# EAGLE schematic DDS Tone Shield (EAGLE 8.1.1)
REV: 0.10
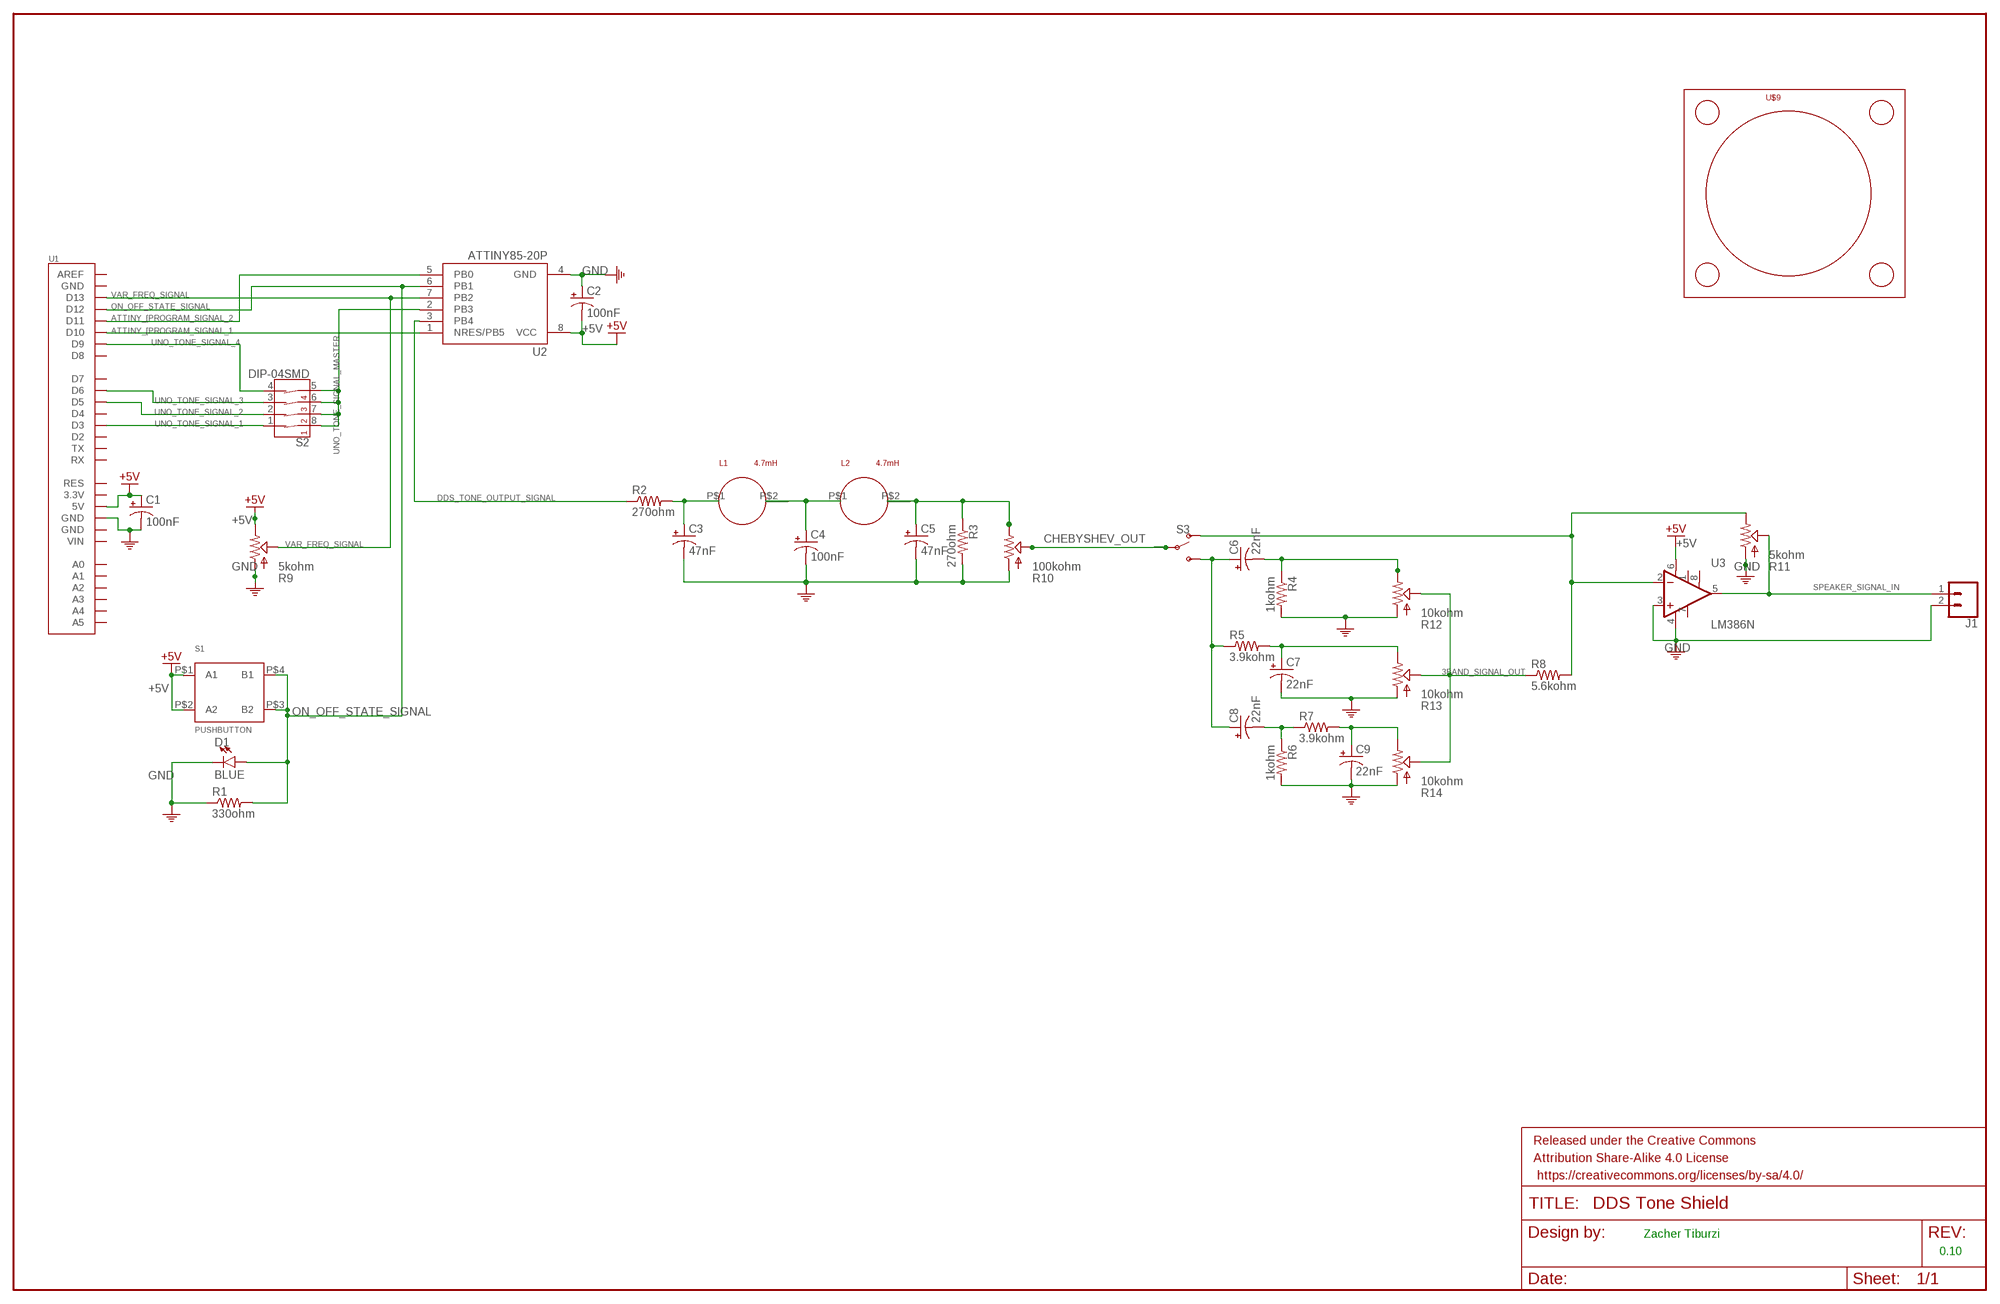
[diagram p0: schematic, sheet 1]

## Parts
C1  100nF  CAP_POL1206  [EIA3216]
C2  100nF  CAP_POL1206  [EIA3216]
C3  47nF  CAP_POL1206  [EIA3216]
C4  100nF  CAP_POL1206  [EIA3216]
C5  47nF  CAP_POL1206  [EIA3216]
C6  22nF  CAP_POL1206  [EIA3216]
C7  22nF  CAP_POL1206  [EIA3216]
C8  22nF  CAP_POL1206  [EIA3216]
C9  22nF  CAP_POL1206  [EIA3216]
D1  BLUE  LED-BLUE1206  [LED-1206]
FRAME2  FRAME-LEDGER  [CREATIVE_COMMONS]
J1  CONN_02  [1X02]
L1  4.7mH  INDUCTOR  [SDR0503-472JL]
L2  4.7mH  INDUCTOR  [SDR0503-472JL]
R1  330ohm  RESISTOR1206  [1206]
R2  270ohm  RESISTOR1206  [1206]
R3  270ohm  RESISTOR1206  [1206]
R4  1kohm  RESISTOR1206  [1206]
R5  3.9kohm  RESISTOR1206  [1206]
R6  1kohm  RESISTOR1206  [1206]
R7  3.9kohm  RESISTOR1206  [1206]
R8  5.6kohm  RESISTOR1206  [1206]
R9  5kohm  POT1  [RK09K/RK09D_SERIES]
R10  100kohm  POT2  [5150500311]
R11  5kohm  POT1  [RK09K/RK09D_SERIES]
R12  10kohm  POT1  [RK09K/RK09D_SERIES]
R13  10kohm  POT1  [RK09K/RK09D_SERIES]
R14  10kohm  POT1  [RK09K/RK09D_SERIES]
S1  PUSHBUTTON  [3CSH9_MEC_PUSHBUTTON]
S2  DIP-04SMD  [DIPSWITCH-04-SMD]
S3  SWITCH-SPDT  [JS102011SAQN]
U1  ARDUINO_SHIELD  [DUEMILANOVE_SHIELD]
U2  ATTINY85-20P  [PDIP08_300MIL]
U3  LM386N  LM386  [DIP08]
U$9  SPEAKER  [CSS-40408N]

## Nets
3BAND_SIGNAL_OUT: R8.1 R12.P$2(S) R13.P$2(S) R14.P$2(S)
+5V: C1.A(+) C2.C(-) R9.P$3(E) S1.P$1(A1) S1.P$2(A2) U1.5V U2.8(VCC) U3.6(V+)
ATTINY_[PROGRAM_SIGNAL_1: U1.D10 U2.1(NRES/PB5)
ATTINY_[PROGRAM_SIGNAL_2: U1.D11 U2.5(PB0)
CHEBYSHEV_OUT: R10.P$20(S) S3.P$3(P)
DDS_TONE_OUTPUT_SIGNAL: R2.1 U2.3(PB4)
GND: C1.C(-) C2.A(+) C3.C(-) C4.C(-) C5.C(-) C7.C(-) C9.C(-) D1.C J1.2 R1.1 R3.2 R4.2 R6.2 R9.P$1(A) R10.P$10(A) R11.P$1(A) R12.P$1(A) R13.P$1(A) R14.P$1(A) U1.GND@1(GND) U2.4(GND) U3.3(+IN) U3.4(V-) ; supply symbol labelled GND_US
N$13: C3.A(+) L1.P$1 R2.2
N$14: C4.A(+) L1.P$2 L2.P$1
N$15: C5.A(+) L2.P$2 R3.1 R10.P$30(E)
N$17: R8.2 R11.P$3(E) S3.P$2(O) U3.2(-IN)
N$18: C6.C(-) R4.1 R12.P$3(E)
N$19: C7.A(+) R5.2 R13.P$3(E)
N$20: C8.C(-) R6.1 R7.1
N$21: C9.A(+) R7.2 R14.P$3(E)
N$26: C6.A(+) C8.A(+) R5.1 S3.P$1(S)
ON_OFF_STATE_SIGNAL: D1.A R1.2 S1.P$3(B2) S1.P$4(B1) U1.D12 U2.6(PB1)
SPEAKER_SIGNAL_IN: J1.1 R11.P$2(S) U3.5(OUT)
UNO_TONE_SIGNAL_1: S2.1(1A) U1.D3
UNO_TONE_SIGNAL_2: S2.2(2A) U1.D5
UNO_TONE_SIGNAL_3: S2.3(3A) U1.D6
UNO_TONE_SIGNAL_4: S2.4(4A) U1.D9
UNO_TONE_SIGNAL_MASTER: S2.5(4B) S2.6(3B) S2.7(2B) S2.8(1B) U2.2(PB3)
VAR_FREQ_SIGNAL: R9.P$2(S) U1.D13 U2.7(PB2)
Unconnected: U1.3.3V U1.A0 U1.A1 U1.A2 U1.A3 U1.A4 U1.A5 U1.AREF U1.D2 U1.D4 U1.D7 U1.D8 U1.GND@0(GND) U1.GND@2(GND) U1.RES U1.RX U1.TX U1.VIN U3.1(GAIN) U3.7(BP) U3.8(GAIN)

## Notes on the sheet
- Zacher Tiburzi

## Library data of the parts
C1-C9 = DDS Tone Shield:CAP_POL: Capacitor Polarized These are standard SMD and PTH capacitors. Normally 10uF, 47uF, and 100uF in electrolytic and tantalum varieties. Always verify the external diameter of the through hole cap, it varies with capacity, voltage, and manufacturer. The EIA devices should be standard.
D1 = DDS Tone Shield:LED-BLUE: Blue SMD LED Used in manufacturing of various products at SparkFun Packages: 0603 - SMD 0603 package [Product Link] <http://www.digikey.com/product-detail/en/SMLE12BC7TT86/511-1589-2-ND/1641808> 1206 - SMD1206 package [Product Link] <http://www.digikey.com/product-detail/en/lite-on-inc/LTST-C150TBKT/160-1643-1-ND/573584> SparkFun Products: ESP8266 Thing-Dev Board <https://www.sparkfun.com/products/13711> RedBoard <https://www.sparkfun.com/products/12757>; PROD_ID: DIO-09911
FRAME2 = 1-Generic:FRAME-LEDGER: Schematic Frame Standard 11x14 US Ledger frame
J1 = DDS Tone Shield:CONN_02: Multi connection point. Often used as Generic Header-pin footprint for 0.1 inch spaced/style header connections On any of the 0.1 inch spaced packages, you can populate with these: Break Away Headers - Straight <https://www.sparkfun.com/products/116> (PRT-00116) Break Away Male Headers - Right Angle <https://www.sparkfun.com/products/553> (PRT-00553) Female Headers <https://www.sparkfun.com/products/115> (PRT-00115) Break Away Headers - Machine Pin <https://www.sparkfun.com/products/117> (PRT-00117) Break Away Female Headers - Swiss Machine Pin <https://www.sparkfun.com/products/743> (PRT-00743) For SCREWTERMINALS and SPRING TERMINALS visit here: Screw Terimnals on SparkFun.com <https://www.sparkfun.com/search/results?term=Screw+Terminals> (5mm/3.5mm/2.54mm spacing) This device is also useful as a general connection point to wire up your design to another part of your project. Our various solder wires solder well into these plated through hole pads. Hook-Up Wire - Assortment (Stranded, 22 AWG) <https://www.sparkfun.com/products/11375> (PRT-11375) Hook-Up Wire - Assortment (Solid Core, 22 AWG) <https://www.sparkfun.com/products/11367> (PRT-11367) View the entire wire category on our website here <https://www.sparkfun.com/categories/141> Special notes: Molex polarized connector foot print use with: PRT-08233 with associated crimp pins and housings. 2.54_SCREWTERM for use with PRT-10571. 3.5mm Screw Terminal footprints for PRT-08084 5mm Screw Terminal footprints for use with PRT-08432
L1 L2 = DDS Tone Shield:INDUCTOR
R1-R8 = DDS Tone Shield:RESISTOR: Resistor Basic schematic elements and footprints for 0603, 1206, and PTH 1/10th watt (small) resistors.
R9 R11-R14 = DDS Tone Shield:POT1
R10 = DDS Tone Shield:POT2
S1 = DDS Tone Shield:PUSHBUTTON: URL: http://www.mouser.com/ds/2/26/3C-3E-1093.pdf
S2 = DDS Tone Shield:DIP-04: 4-Position DIP Switch 4-circuit DIP (dual inline package) switch. Commonly used to physcially set a circuit's behavior. SparkFun Products Prototype Part; PROD_ID: SWCH-12418
S3 = DDS Tone Shield:SWITCH-SPDT: Single Pole, Double Throw (SPDT) Switch Single-pole, double-throw (SPDT) switch. Variant Overview SMD-AYZ0202 Surface Mount DPDT Switch <https://www.sparkfun.com/products/597> (COM-00597) Used on e.g. LilyPad Arduino USB - ATmega32U4 Board <https://www.sparkfun.com/products/12049> PTH-11.6X4.0MM SPDT Mini Power Switch <https://www.sparkfun.com/products/102> (COM-00102) Used on e.g. SparkFun Simon Says - Through-Hole Soldering Kit <https://www.sparkfun.com/products/10547> (KIT-10547) PTH-11.6X4.0MM-KIT KIT version of SPDT Mini Power Switch - Simplifies soldering by removing tStop of switch pins - only one side can be soldered. PTH-11.6X4.0MM-LOCK LOCK version of SPDT Mini Power Switch - Offset pins hold switch in place for easier soldering. SMD-RIGHT-ANGLE Surface Mount Right Angle Switch <https://www.sparkfun.com/products/10860> (COM-10860) Used on e.g. SparkFun ESP8266 Thing <https://www.sparkfun.com/products/13231>
U1 = DDS Tone Shield:ARDUINO_SHIELD
U2 = DDS Tone Shield:ATTINY85*: ATMEL ATtiny 85 Packages: P = PDIP 08 30mil S = SOIC 08 EIAJ 208mil Technologies Note: for complete ordering code (temp. range, finish, tape&reel etc.) see www.atmel.com • Supply Voltage: V = (1.8…5.5)V | [blank] = (2.7…5.5)V • Speed: 10 = 10 MHz | 20 = 20 MHz Author: Dipl.-Ing. FH Rainer Bayer HHN Hochschule Heilbronn (Heilbronn University), rainer.bayer@hs-heilbronn.de Ingenieurbüro ing-rb, mail@ing-rb.de
U3 = DDS Tone Shield:LM386: low voltage audio power amplifier SparkFun Products FabFM Radio Kit <https://www.sparkfun.com/products/11043> (KIT-11043); PROD_ID: IC-10899
U$9 = DDS Tone Shield:SPEAKER